# Altium schematic sheet ETH_1G_MAGNET_HX5084.SchDoc
size A3; SheetNumber: 5; SheetTotal: 22
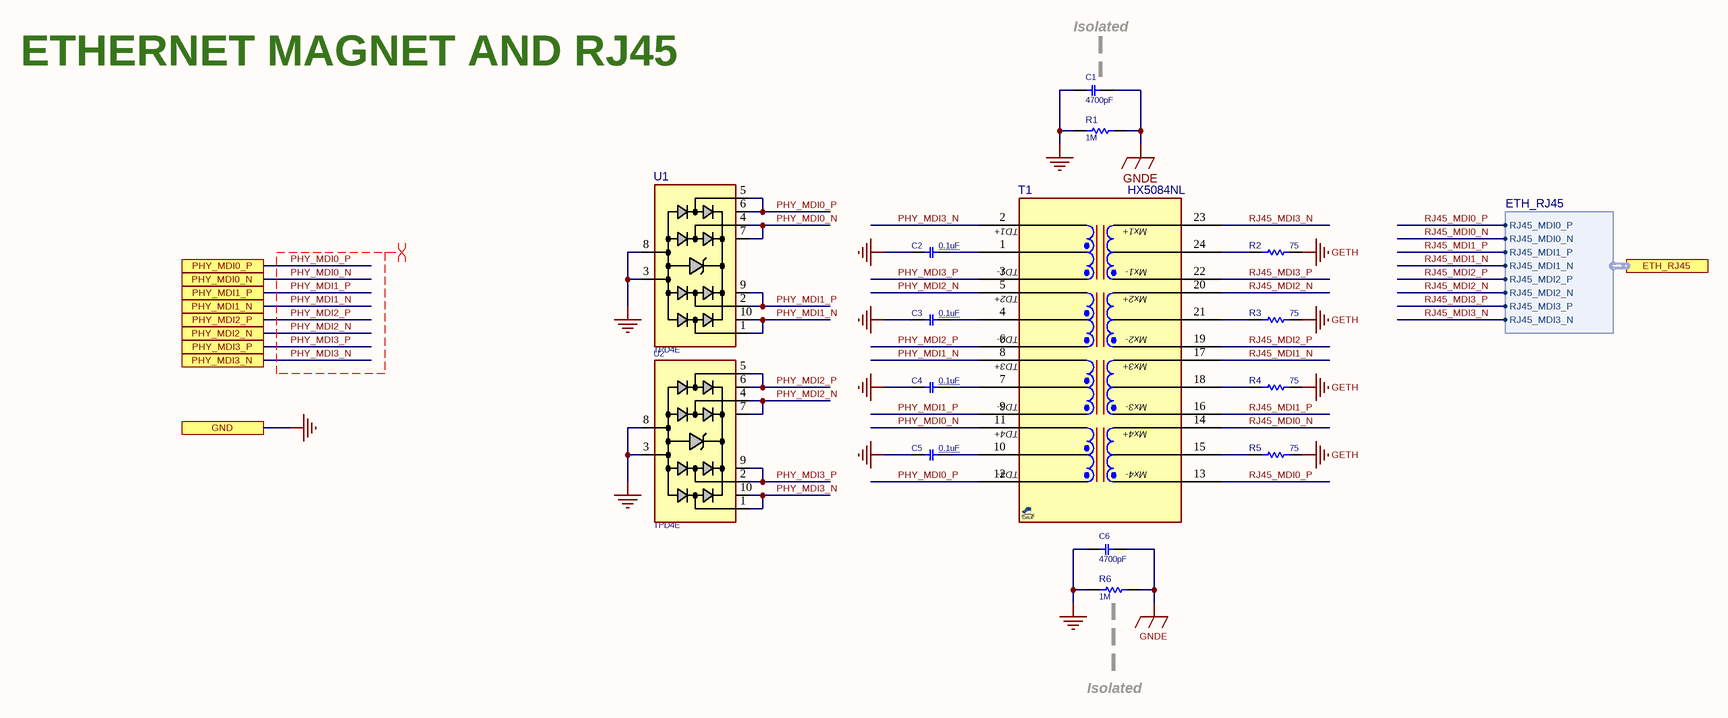
[diagram p0: ETH_1G_MAGNET_HX5084.SchDoc]

## Parts
C1  4700pF  [C1206]
C2  0.1uF  [C0402]
C3  0.1uF  [C0402]
C4  0.1uF  [C0402]
C5  0.1uF  [C0402]
C6  4700pF  [C1206]
R1  1M  [R2512]
R2  75  [R0402]
R3  75  [R0402]
R4  75  [R0402]
R5  75  [R0402]
R6  1M  [R2512]
T1  HX5084NL  [SOG100_24]
U1  TPD4E  [SON50_10_2510]
U2  TPD4E  [SON50_10_2510]

## Ports
ETH_RJ45 (harness ETH_RJ45), GND, PHY_MDI0_N, PHY_MDI0_P, PHY_MDI1_N, PHY_MDI1_P, PHY_MDI2_N, PHY_MDI2_P, PHY_MDI3_N, PHY_MDI3_P

## Harnesses
ETH_RJ45: RJ45_MDI0_P, RJ45_MDI0_N, RJ45_MDI1_P, RJ45_MDI1_N, RJ45_MDI2_P, RJ45_MDI2_N, RJ45_MDI3_P, RJ45_MDI3_N

## Nets
GETH: R2.1 R3.1 R4.1 R5.1
GND: C1.1 C2.2 C3.2 C4.2 C5.2 C6.1 R1.2 R6.2 U1.3 U1.8 U2.3 U2.8 ; port GND
GNDE: C1.2 C6.2 R1.1 R6.1
PHY_MDI0_N: T1.11(TD4+) U1.4 U1.7 ; port PHY_MDI0_N
PHY_MDI0_P: T1.12(TD4-) U1.5 U1.6 ; port PHY_MDI0_P
PHY_MDI1_N: T1.8(TD3+) U1.1 U1.10 ; port PHY_MDI1_N
PHY_MDI1_P: T1.9(TD3-) U1.2 U1.9 ; port PHY_MDI1_P
PHY_MDI2_N: T1.5(TD2+) U2.4 U2.7 ; port PHY_MDI2_N
PHY_MDI2_P: T1.6(TD2-) U2.5 U2.6 ; port PHY_MDI2_P
PHY_MDI3_N: T1.2(TD1+) U2.1 U2.10 ; port PHY_MDI3_N
PHY_MDI3_P: T1.3(TD1-) U2.2 U2.9 ; port PHY_MDI3_P
RJ45_MDI0_N: T1.14(MX4+) ; port ETH_RJ45.RJ45_MDI0_N
RJ45_MDI0_P: T1.13(MX4-) ; port ETH_RJ45.RJ45_MDI0_P
RJ45_MDI1_N: T1.17(MX3+) ; port ETH_RJ45.RJ45_MDI1_N
RJ45_MDI1_P: T1.16(MX3-) ; port ETH_RJ45.RJ45_MDI1_P
RJ45_MDI2_N: T1.20(MX2+) ; port ETH_RJ45.RJ45_MDI2_N
RJ45_MDI2_P: T1.19(MX2-) ; port ETH_RJ45.RJ45_MDI2_P
RJ45_MDI3_N: T1.23(MX1+) ; port ETH_RJ45.RJ45_MDI3_N
RJ45_MDI3_P: T1.22(MX1-) ; port ETH_RJ45.RJ45_MDI3_P
NetC2_1: C2.1 T1.1(TCT1)
NetC3_1: C3.1 T1.4(TCT2)
NetC4_1: C4.1 T1.7(TCT3)
NetC5_1: C5.1 T1.10(TCT4)
NetR2_2: R2.2 T1.24(MCT1)
NetR3_2: R3.2 T1.21(MCT2)
NetR4_2: R4.2 T1.18(MCT3)
NetR5_2: R5.2 T1.15(MCT4)

## Layout directives
differential pair: PHY_MDI0_N, PHY_MDI0_P, PHY_MDI1_N, PHY_MDI1_P, PHY_MDI2_N, PHY_MDI2_P, PHY_MDI3_N, PHY_MDI3_P

## Notes on the sheet
- ETHERNET MAGNET AND RJ45
- Isolated
- (in symbol HX5084NL_SO24) Mx1+; Mx1-; Mx2+; Mx2-; Mx3+; Mx3-; Mx4+; Mx4-

## Library data of the parts
C1 C6 = CAP_SMD_MLCC_68n1kv: CAP, MLCC; MANF_P#: NV1206B472K202CEGN; MANF: KEMET; PARAM: X7R, 10%, -55~125oC; PARAM2: 2000V; PRICE: $0.03; VALUE: 4700pF
C2-C5 = CAP_SMD_MLCC_0402: CAP, MLCC; PARAM: -, -%; MANF_P#: MANF_PART#; PARAM2: 50V; PRICE: 100= 1$; MANF: -; ASSEMBLY: ASSEMBLY; VALUE: 0.1uF
R1 R6 = RES_SMD: RESISTOR, SMD; PARAM: 1W; DESC: DESCRIPTION; MANF_P#: FRC2512J105 TS; MANF: -; ASSEMBLY: ASSEMBLY; PRICE: $0.02; DIST#: -; PARAM2: -; VALUE: 1M
R2-R5 = RES_SMD: RESISTOR, SMD; PARAM: 0.063W; DESC: DESCRIPTION; DIST#: MOUSER; PARAM2: 1%; MANF: -; ASSEMBLY: ASSEMBLY; PRICE: 100= 0.3$; VALUE: 75; MANF_P#: -
T1 = HX5084NL_SO24: Transformer, LAN 10/100/1000 Base-T, 1CT:1CT, 350uH; MANF: Pulse; PARAM2: 1CT:1CT, 350uH, -40~85°C; MANF_P#: HX5084NL; PARAM: LAN 10/100/1000 Base-T; PRICE: 7$; VALUE: HX5084NL
U1 U2 = TVS_X4_TPD4E05U06: TVS, ESD PROTECT, 4CH,; MANF_P#: TPD4E05U06DQA; MANF: Texas Instruments; PARAM2: 6.5Vbr, 0.4pF, –40°~125°C; PARAM: ±12-kV ContactD, ±15-kVAirD; PRICE: 0.6$; VALUE: TPD4E